# Altium project PowerTree.PrjPcb
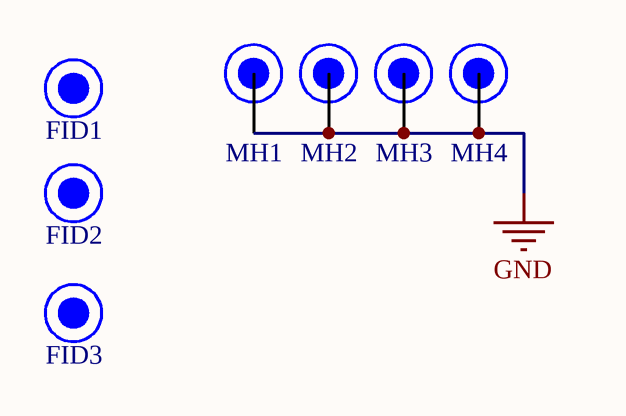
[diagram p0: Title.SchDoc]
Project_Date: 12/03/2019; Project_Designer1: Olivier Belval; Project_Designer2: Philippe Marcoux; Project_Global: SecurBot; Project_Group: SecurBot; Project_Name: PowerTree; Project_Revision: 1
7 sheets, 214 parts. Net scope: global (net labels, ports and power ports of the same name join across sheets).
Board file: PowerTree.PcbDoc
Sheets:
  Title.SchDoc
  Connectors.SchDoc
  DC_DC_5V_1.SchDoc
  DC_DC_5V_2.SchDoc
  DC_DC_12V.SchDoc
  DC_DC_15V_AND_VAR.SchDoc
  Buck Boost 19V.SchDoc

## Sheet Title.SchDoc
size Tabloid; Size: 11x17; Sheet_Name: Sheet Description

### Parts
FID1  Fiducial 1mm  [FID_1MM]  (value not drawn)
FID2  Fiducial 1mm  [FID_1MM]  (value not drawn)
FID3  Fiducial 1mm  [FID_1MM]  (value not drawn)
MH1  Mounting Hole 6/32  [MH_ENG_6-32]  (value not drawn)
MH2  Mounting Hole 6/32  [MH_ENG_6-32]  (value not drawn)
MH3  Mounting Hole 6/32  [MH_ENG_6-32]  (value not drawn)
MH4  Mounting Hole 6/32  [MH_ENG_6-32]  (value not drawn)

### Nets
GND: MH1.1 MH2.1 MH3.1 MH4.1

### Notes on the sheet
- Revision history
- Package size conversion
- Metric
- 1005
- 1608
- Imperial
- 0402
- 0603
- Revision
- 2012
- 3216
- 0805
- 1206
- 3225
- 6432
- 1210
- 2512
- Date :
- Project Title
- Global Project
- Size
- Group
- Date
- Sheet
- of
- Filename
- Designers

### Library data of the parts
FID1-FID3 = FID - 1MM
MH1-MH4 = MH - 6-32

## Sheet Connectors.SchDoc
size Tabloid; Date: Date; Author: Author 1; DocumentNumber: 2; Revision: 1; SheetNumber: 2; SheetTotal: 7; Size: 11x17; Sheet_Name: Connectors
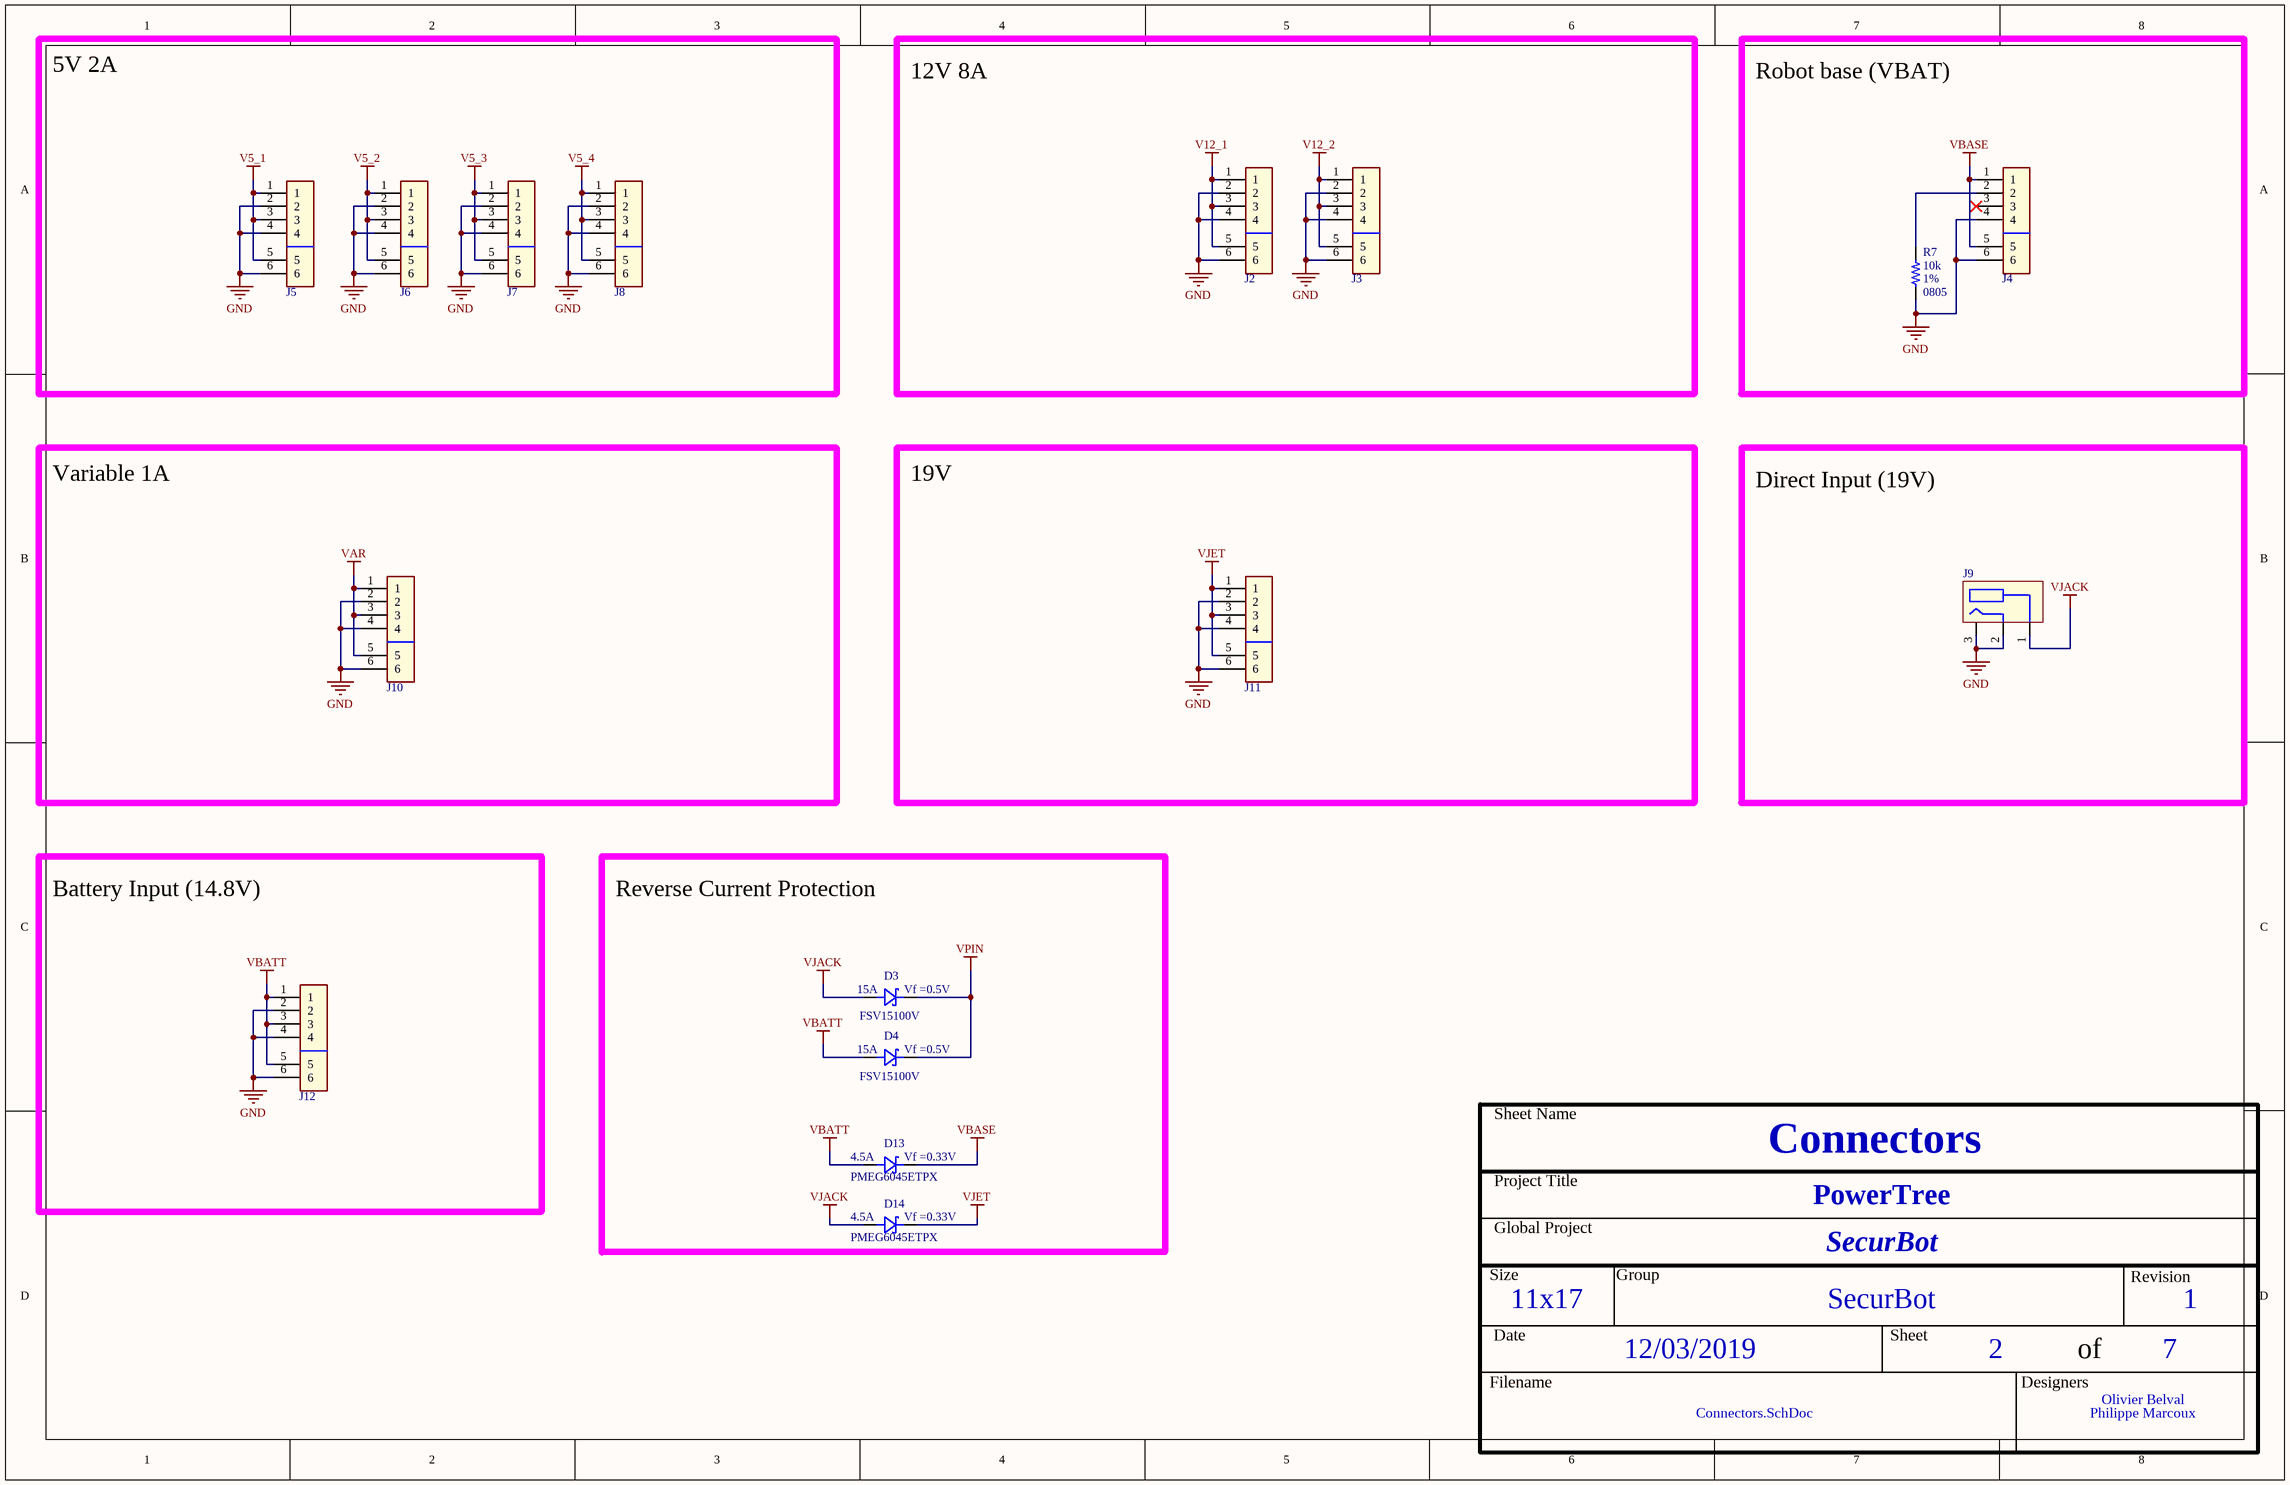
[diagram p1: Connectors.SchDoc]

### Parts
(Parts that share a designator on the sheet are numbered #1, #2 ... from top to bottom, then left to right.)
D3  Current: 15A  Vf: Vf =0.5V  Part number: FSV15100V  [TO277-3]  (hidden comment: SCHOTTKEY)
D4  Current: 15A  Vf: Vf =0.5V  Part number: FSV15100V  [TO277-3]  (hidden comment: SCHOTTKEY)
D13#1  Current: 4.5A  Vf: Vf =0.33V  Part number: PMEG6045ETPX  [DO-214AC_SOD128]  (hidden comment: SCHOTTKEY)
D14#1  Current: 4.5A  Vf: Vf =0.33V  Part number: PMEG6045ETPX  [DO-214AC_SOD128]  (hidden comment: SCHOTTKEY)
J2  MOLEX 4 POS - TERMINAL BLOCK 2 POS  [MOLEX4POS_TERMBLOCK2POS]  (value not drawn)
J3  MOLEX 4 POS - TERMINAL BLOCK 2 POS  [MOLEX4POS_TERMBLOCK2POS]  (value not drawn)
J4  MOLEX 4 POS - TERMINAL BLOCK 2 POS  [MOLEX4POS_TERMBLOCK2POS]  (value not drawn)
J5  MOLEX 4 POS - TERMINAL BLOCK 2 POS  [MOLEX4POS_TERMBLOCK2POS]  (value not drawn)
J6  MOLEX 4 POS - TERMINAL BLOCK 2 POS  [MOLEX4POS_TERMBLOCK2POS]  (value not drawn)
J7  MOLEX 4 POS - TERMINAL BLOCK 2 POS  [MOLEX4POS_TERMBLOCK2POS]  (value not drawn)
J8  MOLEX 4 POS - TERMINAL BLOCK 2 POS  [MOLEX4POS_TERMBLOCK2POS]  (value not drawn)
J9  Barrel 5.5x2.5mm  [Barrel 5.5mm 2.5mm]  (value not drawn)
J10  MOLEX 4 POS - TERMINAL BLOCK 2 POS  [MOLEX4POS_TERMBLOCK2POS]  (value not drawn)
J11  MOLEX 4 POS - TERMINAL BLOCK 2 POS  [MOLEX4POS_TERMBLOCK2POS]  (value not drawn)
J12  MOLEX 4 POS - TERMINAL BLOCK 2 POS  [MOLEX4POS_TERMBLOCK2POS]  (value not drawn)
R7  value 10k  Tolerance: 1%  Package: 0805  [FER_0805]  (hidden comment: RES - 0805)

### Blocks framed on the sheet
5V 2A: J5-J8
12V 8A: J2 J3
Robot base (VBAT): J4 R7
Variable 1A: J10
19V: J11
Direct Input (19V): J9
Battery Input (14.8V): J12
Reverse Current Protection: D3 D4 D13#1 D14#1

### Nets
GND: J2.2 J2.4 J2.6 J3.2 J3.4 J3.6 J4.4 J4.6 J5.2 J5.4 J5.6 J6.2 J6.4 J6.6 J7.2 J7.4 J7.6 J8.2 J8.4 J8.6 J9.2 J9.3 J10.2 J10.4 J10.6 J11.2 J11.4 J11.6 J12.2 J12.4 J12.6 R7.2
V5_1: J5.1 J5.3 J5.5
V5_2: J6.1 J6.3 J6.5
V5_3: J7.1 J7.3 J7.5
V5_4: J8.1 J8.3 J8.5
V12_1: J2.1 J2.3 J2.5
V12_2: J3.1 J3.3 J3.5
VAR: J10.1 J10.3 J10.5
VBASE: D13#1.2 J4.1 J4.5
VBATT: D4.1 D13#1.1 J12.1 J12.3 J12.5
VJACK: D3.1 D14#1.1 J9.1
VJET: D14#1.2 J11.1 J11.3 J11.5
VPIN: D3.2 D4.2
NetJ4_2: J4.2 R7.1

Not connected (* = marked no-connect by the designer): J4 3*

### Notes on the sheet
- Sheet Name
- Project Title
- Global Project
- Size
- Group
- Revision
- Date
- Sheet
- of
- Filename
- Designers

### Library data of the parts
J2-J8 J10-J12 = MOLEX 4 POS - TERMINAL BLOCK 2 POS: Part number: 0039281043; Part number: OSTOQ023250
J9 = Barrel 5.5x2.5mm: Jack 5.5x2.5mm; Part number: PJ-082BH
R7 = RES - 0805: Part number: RMCF0805FT10K0; Watt: ? W

## Sheet DC_DC_5V_1.SchDoc
size Tabloid; DocumentNumber: 3; SheetNumber: 3; SheetTotal: 7; Sheet_Name: 5V page 1
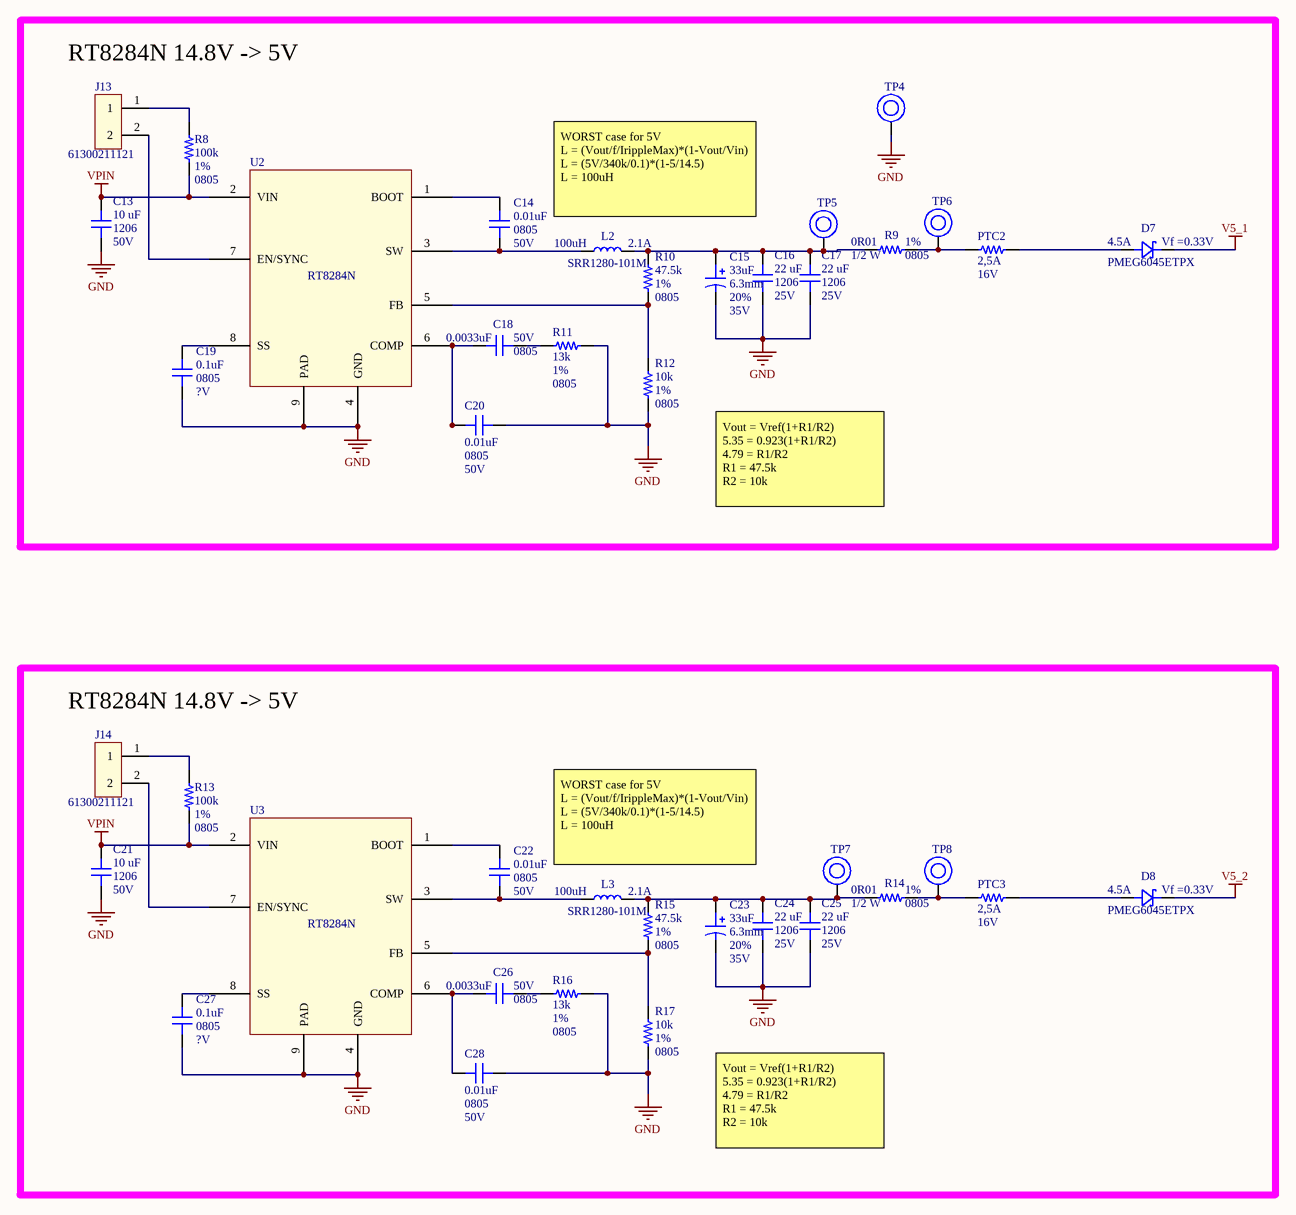
[diagram p2: DC_DC_5V_1.SchDoc]

### Parts
C13  value 10 uF  Package: 1206  Voltage: 50V  [CAP_1206]  (hidden comment: CAP - 1206)
C14  value 0.01uF  Package: 0805  Voltage: 50V  [CAP_0805]  (hidden comment: CAP - 0805)
C15  value 33uF  Package: 6.3mm  Tolerance: 20%  Voltage: 35V  [CAP ALU - 6.3mm DIA]  (hidden comment: CAP ALU - 6.3mm)
C16  value 22 uF  Package: 1206  Voltage: 25V  [CAP_1206]  (hidden comment: CAP - 1206)
C17  value 22 uF  Package: 1206  Voltage: 25V  [CAP_1206]  (hidden comment: CAP - 1206)
C18  value 0.0033uF  Package: 0805  Voltage: 50V  [CAP_0805]  (hidden comment: CAP - 0805)
C19  value 0.1uF  Package: 0805  Voltage: ?V  [CAP_0805]  (hidden comment: CAP - 0805)
C20  value 0.01uF  Package: 0805  Voltage: 50V  [CAP_0805]  (hidden comment: CAP - 0805)
C21  value 10 uF  Package: 1206  Voltage: 50V  [CAP_1206]  (hidden comment: CAP - 1206)
C22  value 0.01uF  Package: 0805  Voltage: 50V  [CAP_0805]  (hidden comment: CAP - 0805)
C23  value 33uF  Package: 6.3mm  Tolerance: 20%  Voltage: 35V  [CAP ALU - 6.3mm DIA]  (hidden comment: CAP ALU - 6.3mm)
C24  value 22 uF  Package: 1206  Voltage: 25V  [CAP_1206]  (hidden comment: CAP - 1206)
C25  value 22 uF  Package: 1206  Voltage: 25V  [CAP_1206]  (hidden comment: CAP - 1206)
C26  value 0.0033uF  Package: 0805  Voltage: 50V  [CAP_0805]  (hidden comment: CAP - 0805)
C27  value 0.1uF  Package: 0805  Voltage: ?V  [CAP_0805]  (hidden comment: CAP - 0805)
C28  value 0.01uF  Package: 0805  Voltage: 50V  [CAP_0805]  (hidden comment: CAP - 0805)
D7  Current: 4.5A  Vf: Vf =0.33V  Part number: PMEG6045ETPX  [DO-214AC_SOD128]  (hidden comment: SCHOTTKEY)
D8  Current: 4.5A  Vf: Vf =0.33V  Part number: PMEG6045ETPX  [DO-214AC_SOD128]  (hidden comment: SCHOTTKEY)
J13  Part number: 61300211121  [HDR1X2]  (hidden comment: Header 2 pin SM)
J14  Part number: 61300211121  [HDR1X2]  (hidden comment: Header 2 pin SM)
L2  value 100uH  Current: 2.1A  Part number: SRR1280-101M  [BOURNS 12.5x12.5mm]  (hidden comment: IND)
L3  value 100uH  Current: 2.1A  Part number: SRR1280-101M  [BOURNS 12.5x12.5mm]  (hidden comment: IND)
PTC2  Trip value: 2,5A  Voltage: 16V  [PTC - 1812]  (hidden comment: PTC - 1812)
PTC3  Trip value: 2,5A  Voltage: 16V  [PTC - 1812]  (hidden comment: PTC - 1812)
R8  value 100k  Tolerance: 1%  Package: 0805  [FER_0805]  (hidden comment: RES - 0805)
R9  value 0R01  Watt: 1/2 W  Tolerance: 1%  Package: 0805  [FER_0805]  (hidden comment: RES - 0805)
R10  value 47.5k  Tolerance: 1%  Package: 0805  [FER_0805]  (hidden comment: RES - 0805)
R11  value 13k  Tolerance: 1%  Package: 0805  [FER_0805]  (hidden comment: RES - 0805)
R12  value 10k  Tolerance: 1%  Package: 0805  [FER_0805]  (hidden comment: RES - 0805)
R13  value 100k  Tolerance: 1%  Package: 0805  [FER_0805]  (hidden comment: RES - 0805)
R14  value 0R01  Watt: 1/2 W  Tolerance: 1%  Package: 0805  [FER_0805]  (hidden comment: RES - 0805)
R15  value 47.5k  Tolerance: 1%  Package: 0805  [FER_0805]  (hidden comment: RES - 0805)
R16  value 13k  Tolerance: 1%  Package: 0805  [FER_0805]  (hidden comment: RES - 0805)
R17  value 10k  Tolerance: 1%  Package: 0805  [FER_0805]  (hidden comment: RES - 0805)
TP4  TestPoint 3x3mm  [TestPoint 3X3mm]  (value not drawn)
TP5  TestPoint 3x3mm  [TestPoint 3X3mm]  (value not drawn)
TP6  TestPoint 3x3mm  [TestPoint 3X3mm]  (value not drawn)
TP7  TestPoint 3x3mm  [TestPoint 3X3mm]  (value not drawn)
TP8  TestPoint 3x3mm  [TestPoint 3X3mm]  (value not drawn)
U2  RT8284N  [SOP8]  (value not drawn)
U3  RT8284N  [SOP8]  (value not drawn)

### Blocks framed on the sheet
RT8284N 14.8V -> 5V: C13-C20 D7 J13 L2 PTC2 R8-R12 TP4-TP6 U2
RT8284N 14.8V -> 5V: C21-C28 D8 J14 L3 PTC3 R13-R17 TP7 TP8 U3

### Nets
GND: C13.2 C15.2 C16.2 C17.2 C19.2 C20.2 C21.2 C23.2 C24.2 C25.2 C27.2 C28.2 R11.2 R12.2 R16.2 R17.2 TP4.1 U2.4(GND) U2.9(PAD) U3.4(GND) U3.9(PAD)
V5_1: D7.2
V5_2: D8.2
VPIN: C13.1 C21.1 R8.1 R13.1 U2.2(VIN) U3.2(VIN)
NetC14_1: C14.1 U2.1(BOOT)
NetC14_2: C14.2 L2.1 U2.3(SW)
NetC15_1: C15.1 C16.1 C17.1 L2.2 R9.1 R10.1 TP5.1
NetC18_1: C18.1 C20.1 U2.6(COMP)
NetC18_2: C18.2 R11.1
NetC19_1: C19.1 U2.8(SS)
NetC22_1: C22.1 U3.1(BOOT)
NetC22_2: C22.2 L3.1 U3.3(SW)
NetC23_1: C23.1 C24.1 C25.1 L3.2 R14.1 R15.1 TP7.1
NetC26_1: C26.1 C28.1 U3.6(COMP)
NetC26_2: C26.2 R16.1
NetC27_1: C27.1 U3.8(SS)
NetD7_1: D7.1 PTC2.2
NetD8_1: D8.1 PTC3.2
NetJ13_1: J13.1 R8.2
NetJ13_2: J13.2 U2.7(EN/SYNC)
NetJ14_1: J14.1 R13.2
NetJ14_2: J14.2 U3.7(EN/SYNC)
NetPTC2_1: PTC2.1 R9.2 TP6.1
NetPTC3_1: PTC3.1 R14.2 TP8.1
NetR10_2: R10.2 R12.1 U2.5(FB)
NetR15_2: R15.2 R17.1 U3.5(FB)

### Notes on the sheet
- WORST case for 5V
  L = (Vout/f/IrippleMax)*(1-Vout/Vin)
  L = (5V/340k/0.1)*(1-5/14.5)
  L = 100uH
- Vout = Vref(1+R1/R2)
  5.35 = 0.923(1+R1/R2)
  4.79 = R1/R2
  R1 = 47.5k
  R2 = 10k
- Sheet Name
- Project Title
- Global Project
- Size
- Group
- Revision
- Date
- Sheet
- of
- Filename
- Designers

### Library data of the parts
C13 C21 = CAP - 1206: Part number: GRT31CR61H106ME01L
C14 C20 C22 C28 = CAP - 0805: Part number: CL21B103KBANNNC
C15 C23 = CAP ALU - 6_3mm: Part number: EEE-FK1V330P
C16 C17 C24 C25 = CAP - 1206: Part number: CL31A226KAHNNNE
C18 C26 = CAP - 0805: Part number: CL21B332KBANNNC
C19 C27 = CAP - 0805: Part number: CC0805KRX7R9BB104
PTC2 PTC3 = PTC - 1812: Part number: 0ZCG0160BF2C; Res: ?; Package: 1812
R8 R13 = RES - 0805: Part number: RMCF0805FT100K; Watt: ? W
R9 R14 = RES - 0805: Part number: KRL1220E-M-R010-F-T5
R10 R15 = RES - 0805: Part number: RMCF0805FT47K5; Watt: ? W
R11 R16 = RES - 0805: Part number: RC0805FR-0713KL; Watt: ? W
R12 R17 = RES - 0805: Part number: RMCF0805FT10K0; Watt: ? W
L2 L3 = IND: Package: ?
U2 U3 = RT8284N: Part number: RT8284N

## Sheet DC_DC_5V_2.SchDoc
size Tabloid; Date: Date; Author: Author 1; DocumentNumber: 4; Revision: 1; SheetNumber: 4; SheetTotal: 7; Size: 11x17; Sheet_Name: 5V page 2
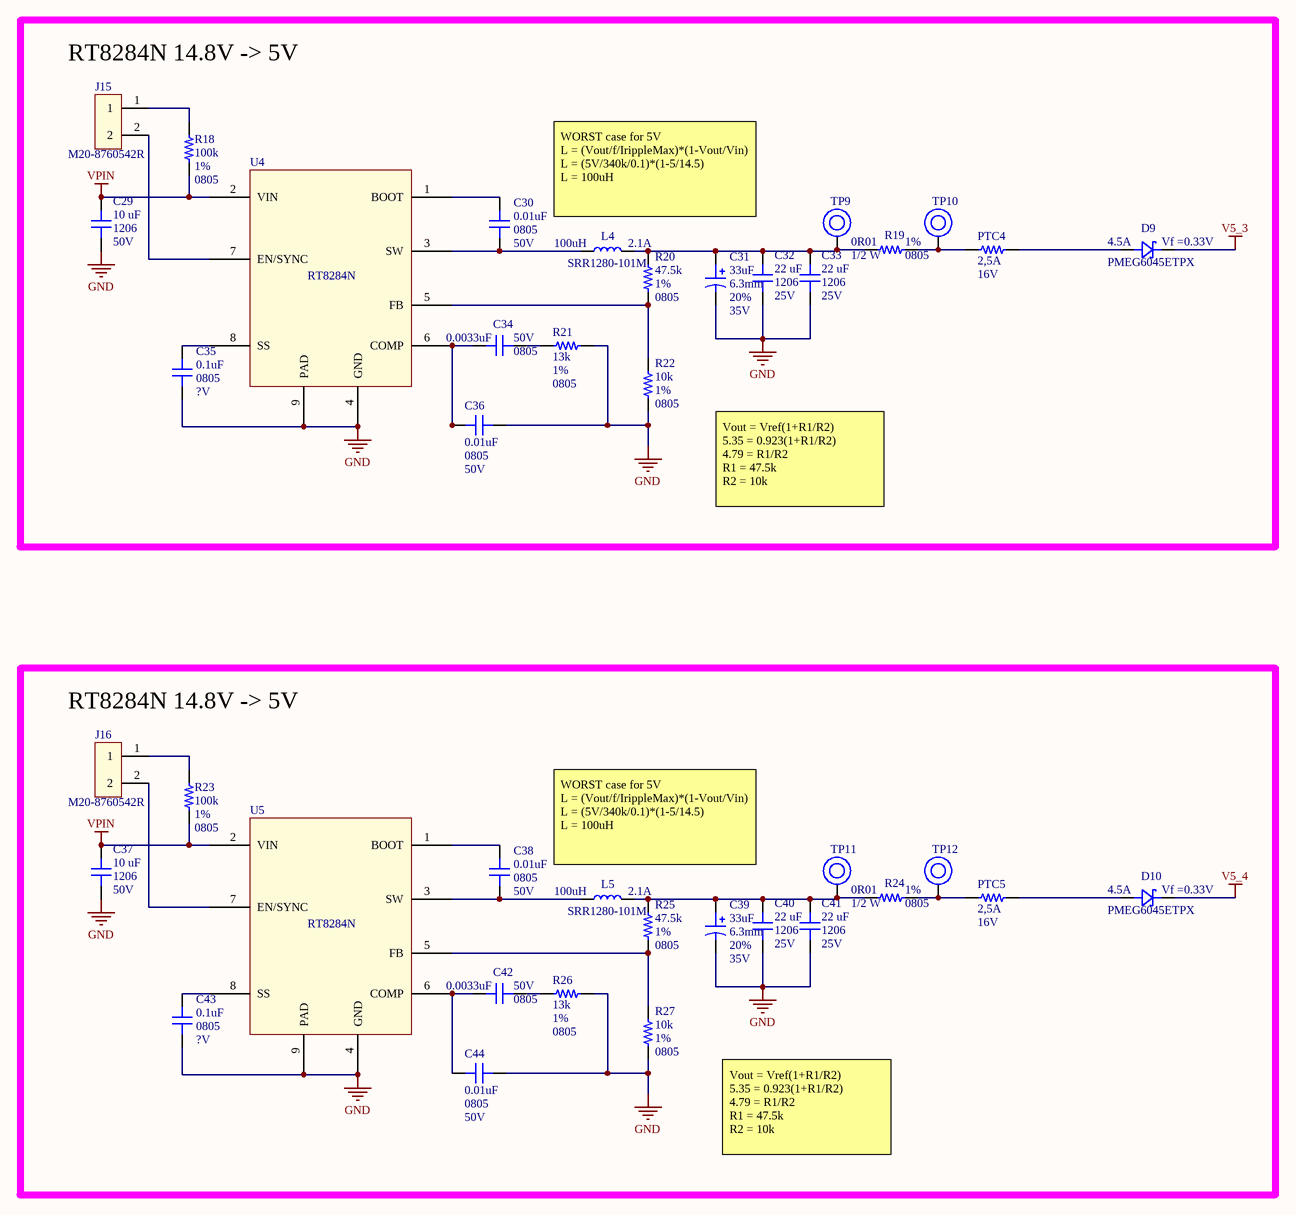
[diagram p3: DC_DC_5V_2.SchDoc]

### Parts
C29  value 10 uF  Package: 1206  Voltage: 50V  [CAP_1206]  (hidden comment: CAP - 1206)
C30  value 0.01uF  Package: 0805  Voltage: 50V  [CAP_0805]  (hidden comment: CAP - 0805)
C31  value 33uF  Package: 6.3mm  Tolerance: 20%  Voltage: 35V  [CAP ALU - 6.3mm DIA]  (hidden comment: CAP ALU - 6.3mm)
C32  value 22 uF  Package: 1206  Voltage: 25V  [CAP_1206]  (hidden comment: CAP - 1206)
C33  value 22 uF  Package: 1206  Voltage: 25V  [CAP_1206]  (hidden comment: CAP - 1206)
C34  value 0.0033uF  Package: 0805  Voltage: 50V  [CAP_0805]  (hidden comment: CAP - 0805)
C35  value 0.1uF  Package: 0805  Voltage: ?V  [CAP_0805]  (hidden comment: CAP - 0805)
C36  value 0.01uF  Package: 0805  Voltage: 50V  [CAP_0805]  (hidden comment: CAP - 0805)
C37  value 10 uF  Package: 1206  Voltage: 50V  [CAP_1206]  (hidden comment: CAP - 1206)
C38  value 0.01uF  Package: 0805  Voltage: 50V  [CAP_0805]  (hidden comment: CAP - 0805)
C39  value 33uF  Package: 6.3mm  Tolerance: 20%  Voltage: 35V  [CAP ALU - 6.3mm DIA]  (hidden comment: CAP ALU - 6.3mm)
C40  value 22 uF  Package: 1206  Voltage: 25V  [CAP_1206]  (hidden comment: CAP - 1206)
C41  value 22 uF  Package: 1206  Voltage: 25V  [CAP_1206]  (hidden comment: CAP - 1206)
C42  value 0.0033uF  Package: 0805  Voltage: 50V  [CAP_0805]  (hidden comment: CAP - 0805)
C43  value 0.1uF  Package: 0805  Voltage: ?V  [CAP_0805]  (hidden comment: CAP - 0805)
C44  value 0.01uF  Package: 0805  Voltage: 50V  [CAP_0805]  (hidden comment: CAP - 0805)
D9  Current: 4.5A  Vf: Vf =0.33V  Part number: PMEG6045ETPX  [DO-214AC_SOD128]  (hidden comment: SCHOTTKEY)
D10  Current: 4.5A  Vf: Vf =0.33V  Part number: PMEG6045ETPX  [DO-214AC_SOD128]  (hidden comment: SCHOTTKEY)
J15  Part number: M20-8760542R  [HDR1X2]  (hidden comment: Header 2 pin SM)
J16  Part number: M20-8760542R  [HDR1X2]  (hidden comment: Header 2 pin SM)
L4  value 100uH  Current: 2.1A  Part number: SRR1280-101M  [BOURNS 12.5x12.5mm]  (hidden comment: IND)
L5  value 100uH  Current: 2.1A  Part number: SRR1280-101M  [BOURNS 12.5x12.5mm]  (hidden comment: IND)
PTC4  Trip value: 2,5A  Voltage: 16V  [PTC - 1812]  (hidden comment: PTC - 1812)
PTC5  Trip value: 2,5A  Voltage: 16V  [PTC - 1812]  (hidden comment: PTC - 1812)
R18  value 100k  Tolerance: 1%  Package: 0805  [FER_0805]  (hidden comment: RES - 0805)
R19  value 0R01  Watt: 1/2 W  Tolerance: 1%  Package: 0805  [FER_0805]  (hidden comment: RES - 0805)
R20  value 47.5k  Tolerance: 1%  Package: 0805  [FER_0805]  (hidden comment: RES - 0805)
R21  value 13k  Tolerance: 1%  Package: 0805  [FER_0805]  (hidden comment: RES - 0805)
R22  value 10k  Tolerance: 1%  Package: 0805  [FER_0805]  (hidden comment: RES - 0805)
R23  value 100k  Tolerance: 1%  Package: 0805  [FER_0805]  (hidden comment: RES - 0805)
R24  value 0R01  Watt: 1/2 W  Tolerance: 1%  Package: 0805  [FER_0805]  (hidden comment: RES - 0805)
R25  value 47.5k  Tolerance: 1%  Package: 0805  [FER_0805]  (hidden comment: RES - 0805)
R26  value 13k  Tolerance: 1%  Package: 0805  [FER_0805]  (hidden comment: RES - 0805)
R27  value 10k  Tolerance: 1%  Package: 0805  [FER_0805]  (hidden comment: RES - 0805)
TP9  TestPoint 3x3mm  [TestPoint 3X3mm]  (value not drawn)
TP10  TestPoint 3x3mm  [TestPoint 3X3mm]  (value not drawn)
TP11  TestPoint 3x3mm  [TestPoint 3X3mm]  (value not drawn)
TP12  TestPoint 3x3mm  [TestPoint 3X3mm]  (value not drawn)
U4  RT8284N  [SOP8]  (value not drawn)
U5  RT8284N  [SOP8]  (value not drawn)

### Blocks framed on the sheet
RT8284N 14.8V -> 5V: C29-C36 D9 J15 L4 PTC4 R18-R22 TP9 TP10 U4
RT8284N 14.8V -> 5V: C37-C44 D10 J16 L5 PTC5 R23-R27 TP11 TP12 U5

### Nets
GND: C29.2 C31.2 C32.2 C33.2 C35.2 C36.2 C37.2 C39.2 C40.2 C41.2 C43.2 C44.2 R21.2 R22.2 R26.2 R27.2 U4.4(GND) U4.9(PAD) U5.4(GND) U5.9(PAD)
V5_3: D9.2
V5_4: D10.2
VPIN: C29.1 C37.1 R18.1 R23.1 U4.2(VIN) U5.2(VIN)
NetC30_1: C30.1 U4.1(BOOT)
NetC30_2: C30.2 L4.1 U4.3(SW)
NetC31_1: C31.1 C32.1 C33.1 L4.2 R19.1 R20.1 TP9.1
NetC34_1: C34.1 C36.1 U4.6(COMP)
NetC34_2: C34.2 R21.1
NetC35_1: C35.1 U4.8(SS)
NetC38_1: C38.1 U5.1(BOOT)
NetC38_2: C38.2 L5.1 U5.3(SW)
NetC39_1: C39.1 C40.1 C41.1 L5.2 R24.1 R25.1 TP11.1
NetC42_1: C42.1 C44.1 U5.6(COMP)
NetC42_2: C42.2 R26.1
NetC43_1: C43.1 U5.8(SS)
NetD9_1: D9.1 PTC4.2
NetD10_1: D10.1 PTC5.2
NetJ15_1: J15.1 R18.2
NetJ15_2: J15.2 U4.7(EN/SYNC)
NetJ16_1: J16.1 R23.2
NetJ16_2: J16.2 U5.7(EN/SYNC)
NetPTC4_1: PTC4.1 R19.2 TP10.1
NetPTC5_1: PTC5.1 R24.2 TP12.1
NetR20_2: R20.2 R22.1 U4.5(FB)
NetR25_2: R25.2 R27.1 U5.5(FB)

### Notes on the sheet
- WORST case for 5V
  L = (Vout/f/IrippleMax)*(1-Vout/Vin)
  L = (5V/340k/0.1)*(1-5/14.5)
  L = 100uH
- Vout = Vref(1+R1/R2)
  5.35 = 0.923(1+R1/R2)
  4.79 = R1/R2
  R1 = 47.5k
  R2 = 10k
- Sheet Name
- Project Title
- Global Project
- Size
- Group
- Revision
- Date
- Sheet
- of
- Filename
- Designers

### Library data of the parts
C29 C37 = CAP - 1206: Part number: GRT31CR61H106ME01L
C30 C36 C38 C44 = CAP - 0805: Part number: CL21B103KBANNNC
C31 C39 = CAP ALU - 6_3mm: Part number: EEE-FK1V330P
C32 C33 C40 C41 = CAP - 1206: Part number: CL31A226KAHNNNE
C34 C42 = CAP - 0805: Part number: CL21B332KBANNNC
C35 C43 = CAP - 0805: Part number: CC0805KRX7R9BB104
PTC4 PTC5 = PTC - 1812: Part number: 0ZCG0160BF2C; Res: ?; Package: 1812
R18 R23 = RES - 0805: Part number: RMCF0805FT100K; Watt: ? W
R19 R24 = RES - 0805: Part number: KRL1220E-M-R010-F-T5
R20 R25 = RES - 0805: Part number: RMCF0805FT47K5; Watt: ? W
R21 R26 = RES - 0805: Part number: RC0805FR-0713KL; Watt: ? W
R22 R27 = RES - 0805: Part number: RMCF0805FT10K0; Watt: ? W
L4 L5 = IND: Package: ?
U4 U5 = RT8284N: Part number: RT8284N

## Sheet DC_DC_12V.SchDoc
size Tabloid; DocumentNumber: 5; SheetNumber: 5; SheetTotal: 7; Sheet_Name: 12V
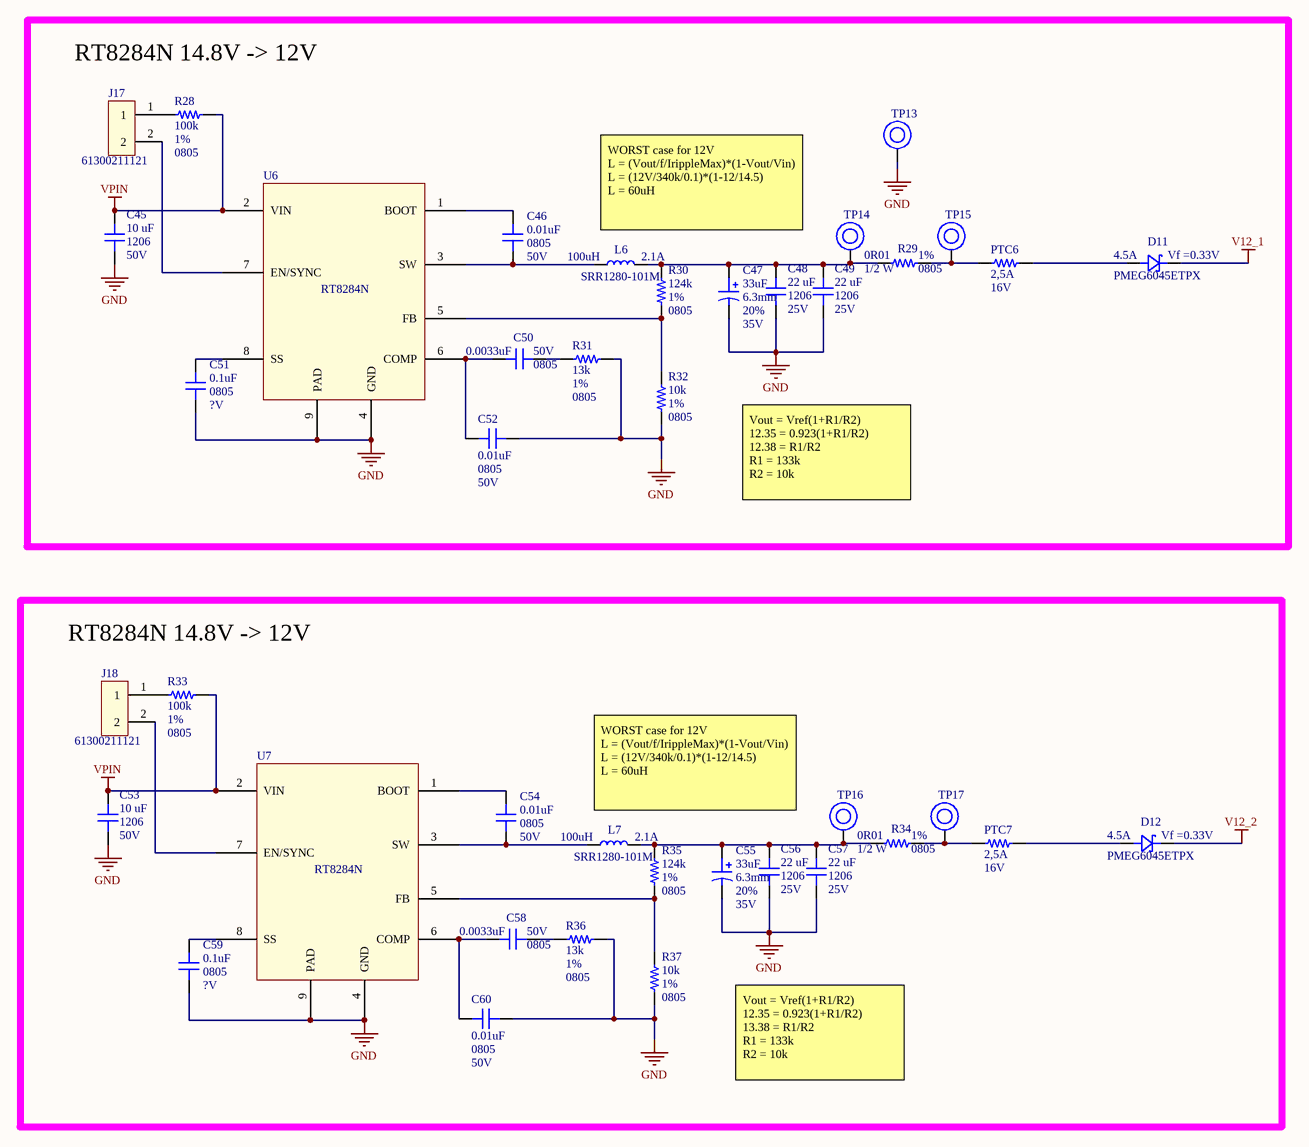
[diagram p4: DC_DC_12V.SchDoc]

### Parts
C45  value 10 uF  Package: 1206  Voltage: 50V  [CAP_1206]  (hidden comment: CAP - 1206)
C46  value 0.01uF  Package: 0805  Voltage: 50V  [CAP_0805]  (hidden comment: CAP - 0805)
C47  value 33uF  Package: 6.3mm  Tolerance: 20%  Voltage: 35V  [CAP ALU - 6.3mm DIA]  (hidden comment: CAP ALU - 6.3mm)
C48  value 22 uF  Package: 1206  Voltage: 25V  [CAP_1206]  (hidden comment: CAP - 1206)
C49  value 22 uF  Package: 1206  Voltage: 25V  [CAP_1206]  (hidden comment: CAP - 1206)
C50  value 0.0033uF  Package: 0805  Voltage: 50V  [CAP_0805]  (hidden comment: CAP - 0805)
C51  value 0.1uF  Package: 0805  Voltage: ?V  [CAP_0805]  (hidden comment: CAP - 0805)
C52  value 0.01uF  Package: 0805  Voltage: 50V  [CAP_0805]  (hidden comment: CAP - 0805)
C53  value 10 uF  Package: 1206  Voltage: 50V  [CAP_1206]  (hidden comment: CAP - 1206)
C54  value 0.01uF  Package: 0805  Voltage: 50V  [CAP_0805]  (hidden comment: CAP - 0805)
C55  value 33uF  Package: 6.3mm  Tolerance: 20%  Voltage: 35V  [CAP ALU - 6.3mm DIA]  (hidden comment: CAP ALU - 6.3mm)
C56  value 22 uF  Package: 1206  Voltage: 25V  [CAP_1206]  (hidden comment: CAP - 1206)
C57  value 22 uF  Package: 1206  Voltage: 25V  [CAP_1206]  (hidden comment: CAP - 1206)
C58  value 0.0033uF  Package: 0805  Voltage: 50V  [CAP_0805]  (hidden comment: CAP - 0805)
C59  value 0.1uF  Package: 0805  Voltage: ?V  [CAP_0805]  (hidden comment: CAP - 0805)
C60  value 0.01uF  Package: 0805  Voltage: 50V  [CAP_0805]  (hidden comment: CAP - 0805)
D11  Current: 4.5A  Vf: Vf =0.33V  Part number: PMEG6045ETPX  [DO-214AC_SOD128]  (hidden comment: SCHOTTKEY)
D12  Current: 4.5A  Vf: Vf =0.33V  Part number: PMEG6045ETPX  [DO-214AC_SOD128]  (hidden comment: SCHOTTKEY)
J17  Part number: 61300211121  [HDR1X2]  (hidden comment: Header 2 pin SM)
J18  Part number: 61300211121  [HDR1X2]  (hidden comment: Header 2 pin SM)
L6  value 100uH  Current: 2.1A  Part number: SRR1280-101M  [BOURNS 12.5x12.5mm]  (hidden comment: IND)
L7  value 100uH  Current: 2.1A  Part number: SRR1280-101M  [BOURNS 12.5x12.5mm]  (hidden comment: IND)
PTC6  Trip value: 2,5A  Voltage: 16V  [PTC - 1812]  (hidden comment: PTC - 1812)
PTC7  Trip value: 2,5A  Voltage: 16V  [PTC - 1812]  (hidden comment: PTC - 1812)
R28  value 100k  Tolerance: 1%  Package: 0805  [FER_0805]  (hidden comment: RES - 0805)
R29  value 0R01  Watt: 1/2 W  Tolerance: 1%  Package: 0805  [FER_0805]  (hidden comment: RES - 0805)
R30  value 124k  Tolerance: 1%  Package: 0805  [FER_0805]  (hidden comment: RES - 0805)
R31  value 13k  Tolerance: 1%  Package: 0805  [FER_0805]  (hidden comment: RES - 0805)
R32  value 10k  Tolerance: 1%  Package: 0805  [FER_0805]  (hidden comment: RES - 0805)
R33  value 100k  Tolerance: 1%  Package: 0805  [FER_0805]  (hidden comment: RES - 0805)
R34  value 0R01  Watt: 1/2 W  Tolerance: 1%  Package: 0805  [FER_0805]  (hidden comment: RES - 0805)
R35  value 124k  Tolerance: 1%  Package: 0805  [FER_0805]  (hidden comment: RES - 0805)
R36  value 13k  Tolerance: 1%  Package: 0805  [FER_0805]  (hidden comment: RES - 0805)
R37  value 10k  Tolerance: 1%  Package: 0805  [FER_0805]  (hidden comment: RES - 0805)
TP13  TestPoint 3x3mm  [TestPoint 3X3mm]  (value not drawn)
TP14  TestPoint 3x3mm  [TestPoint 3X3mm]  (value not drawn)
TP15  TestPoint 3x3mm  [TestPoint 3X3mm]  (value not drawn)
TP16  TestPoint 3x3mm  [TestPoint 3X3mm]  (value not drawn)
TP17  TestPoint 3x3mm  [TestPoint 3X3mm]  (value not drawn)
U6  RT8284N  [SOP8]  (value not drawn)
U7  RT8284N  [SOP8]  (value not drawn)

### Blocks framed on the sheet
RT8284N 14.8V -> 12V: C45-C52 D11 J17 L6 PTC6 R28-R32 TP13-TP15 U6
RT8284N 14.8V -> 12V: C53-C60 D12 J18 L7 PTC7 R33-R37 TP16 TP17 U7

### Nets
GND: C45.2 C47.2 C48.2 C49.2 C51.2 C52.2 C53.2 C55.2 C56.2 C57.2 C59.2 C60.2 R31.2 R32.2 R36.2 R37.2 TP13.1 U6.4(GND) U6.9(PAD) U7.4(GND) U7.9(PAD)
V12_1: D11.2
V12_2: D12.2
VPIN: C45.1 C53.1 R28.2 R33.2 U6.2(VIN) U7.2(VIN)
NetC46_1: C46.1 U6.1(BOOT)
NetC46_2: C46.2 L6.1 U6.3(SW)
NetC47_1: C47.1 C48.1 C49.1 L6.2 R29.1 R30.1 TP14.1
NetC50_1: C50.1 C52.1 U6.6(COMP)
NetC50_2: C50.2 R31.1
NetC51_1: C51.1 U6.8(SS)
NetC54_1: C54.1 U7.1(BOOT)
NetC54_2: C54.2 L7.1 U7.3(SW)
NetC55_1: C55.1 C56.1 C57.1 L7.2 R34.1 R35.1 TP16.1
NetC58_1: C58.1 C60.1 U7.6(COMP)
NetC58_2: C58.2 R36.1
NetC59_1: C59.1 U7.8(SS)
NetD11_1: D11.1 PTC6.2
NetD12_1: D12.1 PTC7.2
NetJ17_1: J17.1 R28.1
NetJ17_2: J17.2 U6.7(EN/SYNC)
NetJ18_1: J18.1 R33.1
NetJ18_2: J18.2 U7.7(EN/SYNC)
NetPTC6_1: PTC6.1 R29.2 TP15.1
NetPTC7_1: PTC7.1 R34.2 TP17.1
NetR30_2: R30.2 R32.1 U6.5(FB)
NetR35_2: R35.2 R37.1 U7.5(FB)

### Notes on the sheet
- WORST case for 12V
  L = (Vout/f/IrippleMax)*(1-Vout/Vin)
  L = (12V/340k/0.1)*(1-12/14.5)
  L = 60uH
- Vout = Vref(1+R1/R2)
  12.35 = 0.923(1+R1/R2)
  12.38 = R1/R2
  R1 = 133k
  R2 = 10k
- Vout = Vref(1+R1/R2)
  12.35 = 0.923(1+R1/R2)
  13.38 = R1/R2
  R1 = 133k
  R2 = 10k
- Sheet Name
- Project Title
- Global Project
- Size
- Group
- Revision
- Date
- Sheet
- of
- Filename
- Designers

### Library data of the parts
C45 C53 = CAP - 1206: Part number: GRT31CR61H106ME01L
C46 C52 C54 C60 = CAP - 0805: Part number: CL21B103KBANNNC
C47 C55 = CAP ALU - 6_3mm: Part number: EEE-FK1V330P
C48 C49 C56 C57 = CAP - 1206: Part number: CL31A226KAHNNNE
C50 C58 = CAP - 0805: Part number: CL21B332KBANNNC
C51 C59 = CAP - 0805: Part number: CC0805KRX7R9BB104
PTC6 PTC7 = PTC - 1812: Part number: 0ZCG0160BF2C; Res: ?; Package: 1812
R28 R33 = RES - 0805: Part number: RMCF0805FT100K; Watt: ? W
R29 R34 = RES - 0805: Part number: KRL1220E-M-R010-F-T5
R30 R35 = RES - 0805: Part number: RMCF0805FT124K; Watt: ? W
R31 R36 = RES - 0805: Part number: RC0805FR-0713KL; Watt: ? W
R32 R37 = RES - 0805: Part number: RMCF0805FT10K0; Watt: ? W
L6 L7 = IND: Package: ?
U6 U7 = RT8284N: Part number: RT8284N

## Sheet DC_DC_15V_AND_VAR.SchDoc
size Tabloid; Date: Date; Author: Author 1; DocumentNumber: 6; Revision: 1; SheetNumber: 6; SheetTotal: 7; Size: 11x17; Sheet_Name: 15V and Variable V
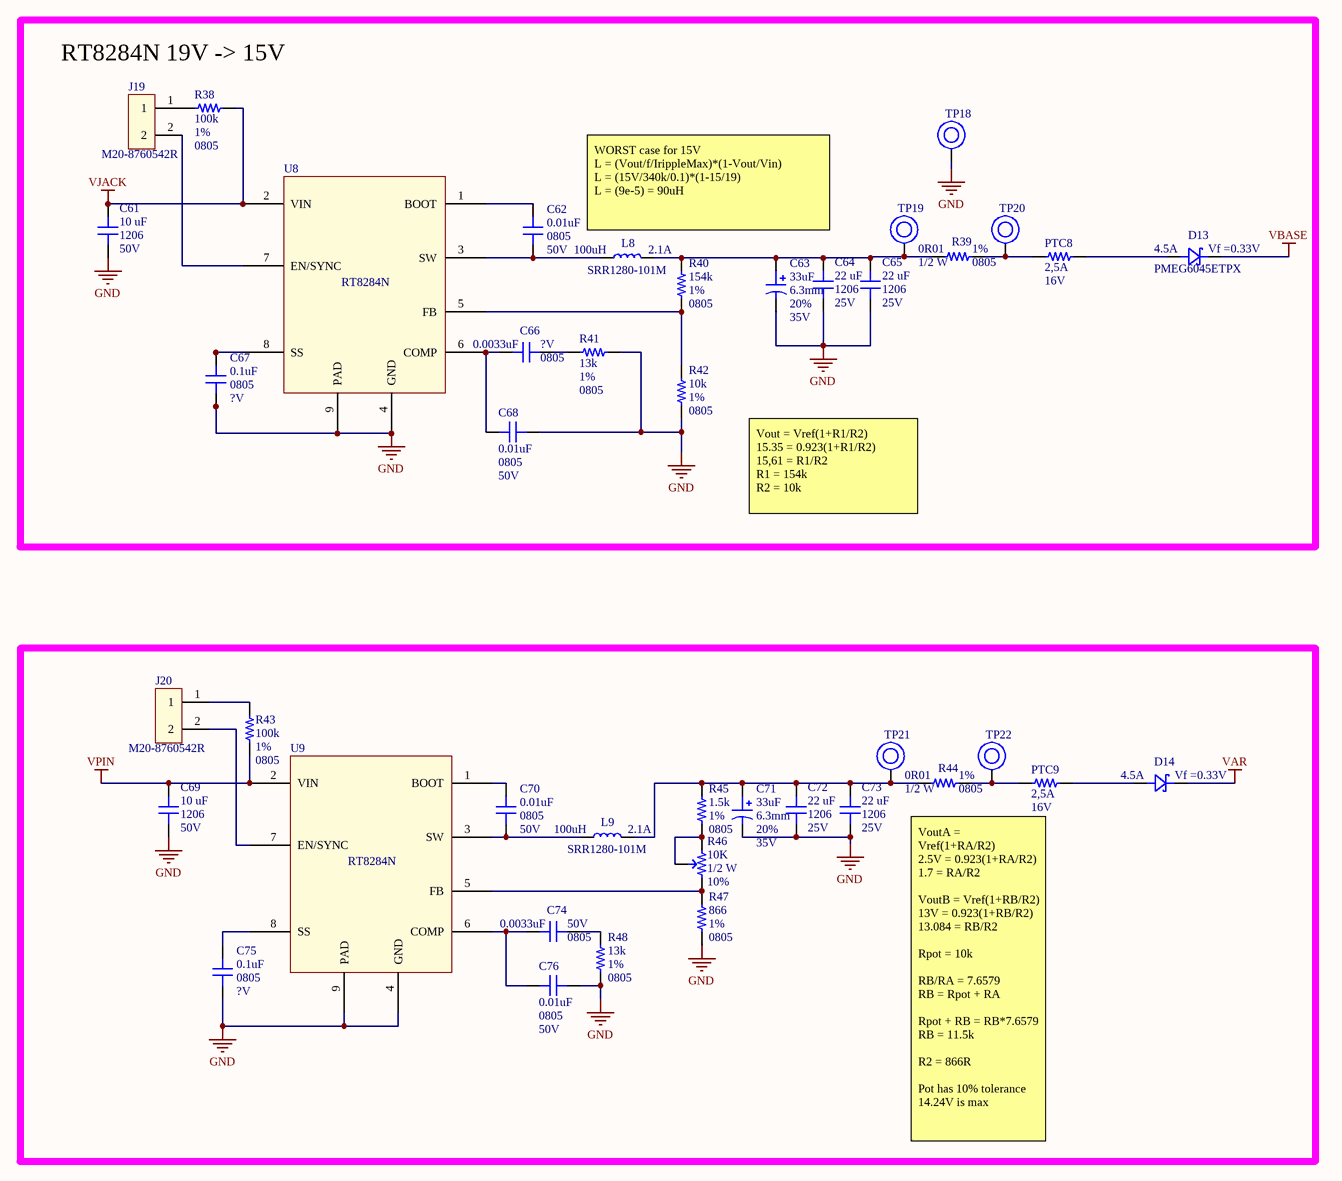
[diagram p5: DC_DC_15V_AND_VAR.SchDoc]

### Parts
(Parts that share a designator on the sheet are numbered #1, #2 ... from top to bottom, then left to right.)
C61  value 10 uF  Package: 1206  Voltage: 50V  [CAP_1206]  (hidden comment: CAP - 1206)
C62  value 0.01uF  Package: 0805  Voltage: 50V  [CAP_0805]  (hidden comment: CAP - 0805)
C63  value 33uF  Package: 6.3mm  Tolerance: 20%  Voltage: 35V  [CAP ALU - 6.3mm DIA]  (hidden comment: CAP ALU - 6.3mm)
C64  value 22 uF  Package: 1206  Voltage: 25V  [CAP_1206]  (hidden comment: CAP - 1206)
C65  value 22 uF  Package: 1206  Voltage: 25V  [CAP_1206]  (hidden comment: CAP - 1206)
C66  value 0.0033uF  Package: 0805  Voltage: ?V  [CAP_0805]  (hidden comment: CAP - 0805)
C67  value 0.1uF  Package: 0805  Voltage: ?V  [CAP_0805]  (hidden comment: CAP - 0805)
C68  value 0.01uF  Package: 0805  Voltage: 50V  [CAP_0805]  (hidden comment: CAP - 0805)
C69  value 10 uF  Package: 1206  Voltage: 50V  [CAP_1206]  (hidden comment: CAP - 1206)
C70  value 0.01uF  Package: 0805  Voltage: 50V  [CAP_0805]  (hidden comment: CAP - 0805)
C71  value 33uF  Package: 6.3mm  Tolerance: 20%  Voltage: 35V  [CAP ALU - 6.3mm DIA]  (hidden comment: CAP ALU - 6.3mm)
C72  value 22 uF  Package: 1206  Voltage: 25V  [CAP_1206]  (hidden comment: CAP - 1206)
C73  value 22 uF  Package: 1206  Voltage: 25V  [CAP_1206]  (hidden comment: CAP - 1206)
C74  value 0.0033uF  Package: 0805  Voltage: 50V  [CAP_0805]  (hidden comment: CAP - 0805)
C75  value 0.1uF  Package: 0805  Voltage: ?V  [CAP_0805]  (hidden comment: CAP - 0805)
C76  value 0.01uF  Package: 0805  Voltage: 50V  [CAP_0805]  (hidden comment: CAP - 0805)
D13#2  Current: 4.5A  Vf: Vf =0.33V  Part number: PMEG6045ETPX  [DO-214AC_SOD128]  (hidden comment: SCHOTTKEY)
D14#2  Current: 4.5A  Vf: Vf =0.33V  [DO-214AC_SOD128]  (hidden comment: SCHOTTKEY)
J19  Part number: M20-8760542R  [HDR1X2]  (hidden comment: Header 2 pin SM)
J20  Part number: M20-8760542R  [HDR1X2]  (hidden comment: Header 2 pin SM)
L8  value 100uH  Current: 2.1A  Part number: SRR1280-101M  [BOURNS 12.5x12.5mm]  (hidden comment: IND)
L9  value 100uH  Current: 2.1A  Part number: SRR1280-101M  [BOURNS 12.5x12.5mm]  (hidden comment: IND)
PTC8  Trip value: 2,5A  Voltage: 16V  [PTC - 1812]  (hidden comment: PTC - 1812)
PTC9  Trip value: 2,5A  Voltage: 16V  [PTC - 1812]  (hidden comment: PTC - 1812)
R38  value 100k  Tolerance: 1%  Package: 0805  [FER_0805]  (hidden comment: RES - 0805)
R39  value 0R01  Watt: 1/2 W  Tolerance: 1%  Package: 0805  [FER_0805]  (hidden comment: RES - 0805)
R40  value 154k  Tolerance: 1%  Package: 0805  [FER_0805]  (hidden comment: RES - 0805)
R41  value 13k  Tolerance: 1%  Package: 0805  [FER_0805]  (hidden comment: RES - 0805)
R42  value 10k  Tolerance: 1%  Package: 0805  [FER_0805]  (hidden comment: RES - 0805)
R43  value 100k  Tolerance: 1%  Package: 0805  [FER_0805]  (hidden comment: RES - 0805)
R44  value 0R01  Watt: 1/2 W  Tolerance: 1%  Package: 0805  [FER_0805]  (hidden comment: RES - 0805)
R45  value 1.5k  Tolerance: 1%  Package: 0805  [FER_0805]  (hidden comment: RES - 0805)
R46  value 10K  Watt: 1/2 W  Tolerance: 10%  [3361P]  (hidden comment: Pot)
R47  value 866  Tolerance: 1%  Package: 0805  [FER_0805]  (hidden comment: RES - 0805)
R48  value 13k  Tolerance: 1%  Package: 0805  [FER_0805]  (hidden comment: RES - 0805)
TP18  TestPoint 3x3mm  [TestPoint 3X3mm]  (value not drawn)
TP19  TestPoint 3x3mm  [TestPoint 3X3mm]  (value not drawn)
TP20  TestPoint 3x3mm  [TestPoint 3X3mm]  (value not drawn)
TP21  TestPoint 3x3mm  [TestPoint 3X3mm]  (value not drawn)
TP22  TestPoint 3x3mm  [TestPoint 3X3mm]  (value not drawn)
U8  RT8284N  [SOP8]  (value not drawn)
U9  RT8284N  [SOP8]  (value not drawn)

### Blocks framed on the sheet
RT8284N 19V -> 15V: C61-C68 D13#2 J19 L8 PTC8 R38-R42 TP18-TP20 U8

### Nets
GND: C61.2 C63.2 C64.2 C65.2 C67.2 C68.2 C69.2 C71.2 C72.2 C73.2 C75.2 C76.2 R41.2 R42.2 R47.2 R48.1 TP18.1 U8.4(GND) U8.9(PAD) U9.4(GND) U9.9(PAD)
VAR: D14#2.2
VBASE: D13#2.2
VJACK: C61.1 R38.2 U8.2(VIN)
VPIN: C69.1 R43.1 U9.2(VIN)
NetC62_1: C62.1 U8.1(BOOT)
NetC62_2: C62.2 L8.1 U8.3(SW)
NetC63_1: C63.1 C64.1 C65.1 L8.2 R39.1 R40.1 TP19.1
NetC66_1: C66.1 C68.1 U8.6(COMP)
NetC66_2: C66.2 R41.1
NetC67_1: C67.1 U8.8(SS)
NetC70_1: C70.1 U9.1(BOOT)
NetC70_2: C70.2 L9.1 U9.3(SW)
NetC71_1: C71.1 C72.1 C73.1 L9.2 R44.1 R45.1 TP21.1
NetC74_1: C74.1 C76.1 U9.6(COMP)
NetC74_2: C74.2 R48.2
NetC75_1: C75.1 U9.8(SS)
NetD13#2_1: D13#2.1 PTC8.2
NetD14#2_1: D14#2.1 PTC9.2
NetJ19_1: J19.1 R38.1
NetJ19_2: J19.2 U8.7(EN/SYNC)
NetJ20_1: J20.1 R43.2
NetJ20_2: J20.2 U9.7(EN/SYNC)
NetPTC8_1: PTC8.1 R39.2 TP20.1
NetPTC9_1: PTC9.1 R44.2 TP22.1
NetR40_2: R40.2 R42.1 U8.5(FB)
NetR45_2: R45.2 R46.1 R46.3
NetR46_2: R46.2 R47.1 U9.5(FB)

### Notes on the sheet
- WORST case for 15V
  L = (Vout/f/IrippleMax)*(1-Vout/Vin)
  L = (15V/340k/0.1)*(1-15/19)
  L = (9e-5) = 90uH
- Vout = Vref(1+R1/R2)
  15.35 = 0.923(1+R1/R2)
  15,61 = R1/R2
  R1 = 154k
  R2 = 10k
- VoutA = Vref(1+RA/R2)
  2.5V = 0.923(1+RA/R2)
  1.7 = RA/R2
  VoutB = Vref(1+RB/R2)
  13V = 0.923(1+RB/R2)
  13.084 = RB/R2
  Rpot = 10k
  RB/RA = 7.6579
  RB = Rpot + RA
  Rpot + RB = RB*7.6579
  RB = 11.5k
  R2 = 866R
  Pot has 10% tolerance
  14.24V is max
- Sheet Name
- Project Title
- Global Project
- Size
- Group
- Revision
- Date
- Sheet
- of
- Filename
- Designers

### Library data of the parts
C61 C69 = CAP - 1206: Part number: GRT31CR61H106ME01L
C62 C68 C70 C76 = CAP - 0805: Part number: CL21B103KBANNNC
C63 C71 = CAP ALU - 6_3mm: Part number: EEE-FK1V330P
C64 C65 C72 C73 = CAP - 1206: Part number: CL31A226KAHNNNE
C66 C74 = CAP - 0805: Part number: CL21B332KBANNNC
C67 C75 = CAP - 0805: Part number: CC0805KRX7R9BB104
D14#2 = SCHOTTKEY: Part number: PMEG6045ETPX
PTC8 PTC9 = PTC - 1812: Part number: 0ZCG0160BF2C; Res: ?; Package: 1812
R38 R43 = RES - 0805: Part number: RMCF0805FT100K; Watt: ? W
R39 R44 = RES - 0805: Part number: KRL1220E-M-R010-F-T5
R40 = RES - 0805: Part number: RC0805FR-07154KL; Watt: ? W
R41 R48 = RES - 0805: Part number: RC0805FR-0713KL; Watt: ? W
R42 = RES - 0805: Part number: RMCF0805FT10K0; Watt: ? W
R45 = RES - 0805: Part number: CRCW08051K50FKEA; Watt: ? W
R46 = Pot: Part number: 3361P-1-103GLF; Package: ?
R47 = RES - 0805: Part number: RC0805FR-07866RL; Watt: ? W
L8 L9 = IND: Package: ?
U8 U9 = RT8284N: Part number: RT8284N

## Sheet Buck Boost 19V.SchDoc
size Tabloid; Date: Date; Author: Author 1; DocumentNumber: 7; Revision: 1; SheetNumber: 7; SheetTotal: 7; Size: 11x17; Sheet_Name: Boost 19V
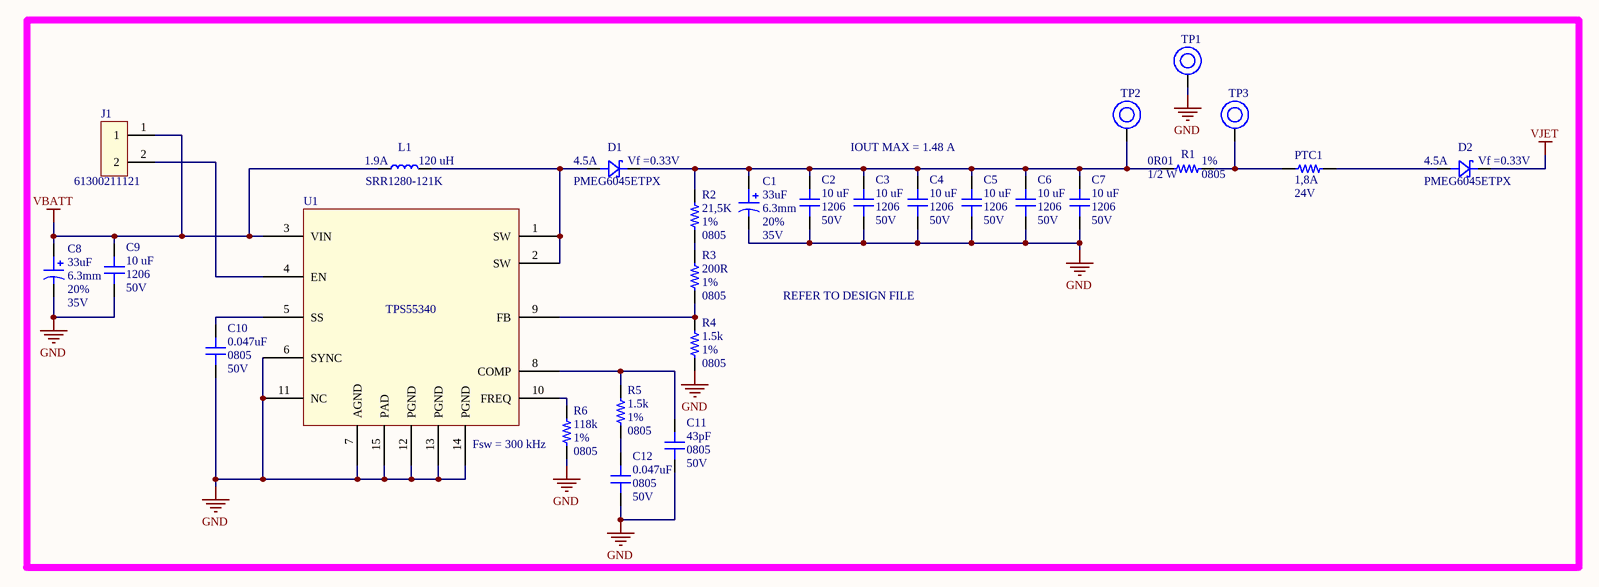
[diagram p6: Buck Boost 19V.SchDoc]

### Parts
C1  value 33uF  Package: 6.3mm  Tolerance: 20%  Voltage: 35V  [CAP ALU - 6.3mm DIA]  (hidden comment: CAP ALU - 6.3mm)
C2  value 10 uF  Package: 1206  Voltage: 50V  [CAP_1206]  (hidden comment: CAP - 1206)
C3  value 10 uF  Package: 1206  Voltage: 50V  [CAP_1206]  (hidden comment: CAP - 1206)
C4  value 10 uF  Package: 1206  Voltage: 50V  [CAP_1206]  (hidden comment: CAP - 1206)
C5  value 10 uF  Package: 1206  Voltage: 50V  [CAP_1206]  (hidden comment: CAP - 1206)
C6  value 10 uF  Package: 1206  Voltage: 50V  [CAP_1206]  (hidden comment: CAP - 1206)
C7  value 10 uF  Package: 1206  Voltage: 50V  [CAP_1206]  (hidden comment: CAP - 1206)
C8  value 33uF  Package: 6.3mm  Tolerance: 20%  Voltage: 35V  [CAP ALU - 6.3mm DIA]  (hidden comment: CAP ALU - 6.3mm)
C9  value 10 uF  Package: 1206  Voltage: 50V  [CAP_1206]  (hidden comment: CAP - 1206)
C10  value 0.047uF  Package: 0805  Voltage: 50V  [CAP_0805]  (hidden comment: CAP - 0805)
C11  value 43pF  Package: 0805  Voltage: 50V  [CAP_0805]  (hidden comment: CAP - 0805)
C12  value 0.047uF  Package: 0805  Voltage: 50V  [CAP_0805]  (hidden comment: CAP - 0805)
D1  Current: 4.5A  Vf: Vf =0.33V  Part number: PMEG6045ETPX  [DO-214AC_SOD128]  (hidden comment: SCHOTTKEY)
D2  Current: 4.5A  Vf: Vf =0.33V  Part number: PMEG6045ETPX  [DO-214AC_SOD128]  (hidden comment: SCHOTTKEY)
J1  Part number: 61300211121  [HDR1X2]  (hidden comment: Header 2 pin SM)
L1  value 120 uH  Current: 1.9A  Part number: SRR1280-121K  [BOURNS 12.5x12.5mm]  (hidden comment: IND)
PTC1  Trip value: 1,8A  Voltage: 24V  [PTC - 1812]  (hidden comment: PTC - 1812)
R1  value 0R01  Watt: 1/2 W  Tolerance: 1%  Package: 0805  [FER_0805]  (hidden comment: RES - 0805)
R2  value 21,5K  Tolerance: 1%  Package: 0805  [FER_0805]  (hidden comment: RES - 0805)
R3  value 200R  Tolerance: 1%  Package: 0805  [FER_0805]  (hidden comment: RES - 0805)
R4  value 1.5k  Tolerance: 1%  Package: 0805  [FER_0805]  (hidden comment: RES - 0805)
R5  value 1.5k  Tolerance: 1%  Package: 0805  [FER_0805]  (hidden comment: RES - 0805)
R6  value 118k  Tolerance: 1%  Package: 0805  [FER_0805]  (hidden comment: RES - 0805)
TP1  TestPoint 3x3mm  [TestPoint 3X3mm]  (value not drawn)
TP2  TestPoint 3x3mm  [TestPoint 3X3mm]  (value not drawn)
TP3  TestPoint 3x3mm  [TestPoint 3X3mm]  (value not drawn)
U1  TPS55340  [14-TSSOP]  (value not drawn)

### Nets
GND: C1.2 C2.2 C3.2 C4.2 C5.2 C6.2 C7.2 C8.2 C9.2 C10.2 C11.2 C12.2 R4.2 R6.2 TP1.1 U1.6(SYNC) U1.7(AGND) U1.11(NC) U1.12(PGND) U1.13(PGND) U1.14(PGND) U1.15(PAD)
VBATT: C8.1 C9.1 J1.1 L1.1 U1.3(VIN)
VJET: D2.2
NetC1_1: C1.1 C2.1 C3.1 C4.1 C5.1 C6.1 C7.1 D1.2 R1.1 R2.1 TP2.1
NetC10_1: C10.1 U1.5(SS)
NetC11_1: C11.1 R5.1 U1.8(COMP)
NetC12_1: C12.1 R5.2
NetD1_1: D1.1 L1.2 U1.1(SW) U1.2(SW)
NetD2_1: D2.1 PTC1.2
NetJ1_2: J1.2 U1.4(EN)
NetPTC1_1: PTC1.1 R1.2 TP3.1
NetR2_2: R2.2 R3.1
NetR3_2: R3.2 R4.1 U1.9(FB)
NetR6_1: R6.1 U1.10(FREQ)

### Notes on the sheet
- IOUT MAX = 1.48 A
- REFER TO DESIGN FILE
- Fsw = 300 kHz
- Sheet Name
- Project Title
- Global Project
- Size
- Group
- Revision
- Date
- Sheet
- of
- Filename
- Designers

### Library data of the parts
C1 C8 = CAP ALU - 6_3mm: Part number: EEE-FK1V330P
C2-C7 C9 = CAP - 1206: Part number: GRT31CR61H106ME01L
C10 C12 = CAP - 0805: Part number: C0805C473K5RACTU
C11 = CAP - 0805: Part number: C0805C430J5GAC7800
PTC1 = PTC - 1812: Part number: 0ZCG0110BF2B; Res: ?; Package: 1812
R1 = RES - 0805: Part number: KRL1220E-M-R010-F-T5
R2 = RES - 0805: Part number: ERJ-6ENF2152V; Watt: 1/8 W
R3 = RES - 0805: Part number: CRCW0805200RFKEA; Watt: 1/8 W
R4 R5 = RES - 0805: Part number: CRCW08051K50FKEA; Watt: ? W
R6 = RES - 0805: Part number: CRCW0805118KFKEA; Watt: ? W
L1 = IND: Package: ?
U1 = TPS55340: Part number: TPS55340

## Nets that join several sheets
GND: Title (MH1.1 MH2.1 MH3.1 MH4.1), Connectors (32 pins), DC_DC_5V_1 (21 pins), DC_DC_5V_2 (20 pins), DC_DC_12V (21 pins), DC_DC_15V_AND_VAR (21 pins), Buck Boost 19V (22 pins)
V5_1: Connectors (J5.1 J5.3 J5.5), DC_DC_5V_1 (D7.2)
V5_2: Connectors (J6.1 J6.3 J6.5), DC_DC_5V_1 (D8.2)
V5_3: Connectors (J7.1 J7.3 J7.5), DC_DC_5V_2 (D9.2)
V5_4: Connectors (J8.1 J8.3 J8.5), DC_DC_5V_2 (D10.2)
V12_1: Connectors (J2.1 J2.3 J2.5), DC_DC_12V (D11.2)
V12_2: Connectors (J3.1 J3.3 J3.5), DC_DC_12V (D12.2)
VAR: Connectors (J10.1 J10.3 J10.5), DC_DC_15V_AND_VAR (D14#2.2)
VBASE: Connectors (D13#1.2 J4.1 J4.5), DC_DC_15V_AND_VAR (D13#2.2)
VBATT: Connectors (5 pins), Buck Boost 19V (5 pins)
VJACK: Connectors (D3.1 D14#1.1 J9.1), DC_DC_15V_AND_VAR (C61.1 R38.2 U8.2)
VJET: Connectors (D14#1.2 J11.1 J11.3 J11.5), Buck Boost 19V (D2.2)
VPIN: Connectors (D3.2 D4.2), DC_DC_5V_1 (6 pins), DC_DC_5V_2 (6 pins), DC_DC_12V (6 pins), DC_DC_15V_AND_VAR (C69.1 R43.1 U9.2)